# EAGLE schematic BatteryPCB2997 (EAGLE 7.2.0)
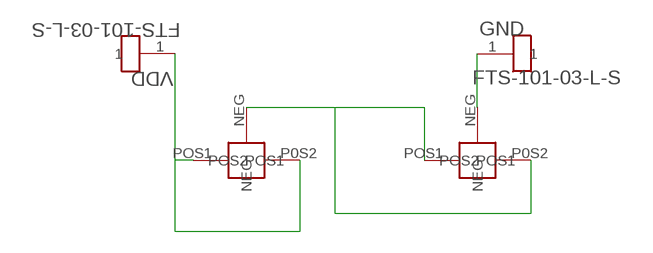
[diagram p0: schematic, sheet 1]

## Parts
GND  FTS-101-03-L-S  [SAMTEC_FTS-101-03-S]
U$3  2997  [2997]
U$4  2997  [2997]
VDD  FTS-101-03-L-S  [SAMTEC_FTS-101-03-S]

## Nets
N$1: U$3.NEG U$4.P0S2(POS2) U$4.POS1
N$2: GND.1 U$4.NEG
N$3: U$3.P0S2(POS2) U$3.POS1 VDD.1

## Library data of the parts
GND VDD = samtec_fts:FTS-101-03-L-S
U$3 U$4 = keystone-battery-holder:2997